# EAGLE design Card4to16_50mm (EAGLE 8.1.1)
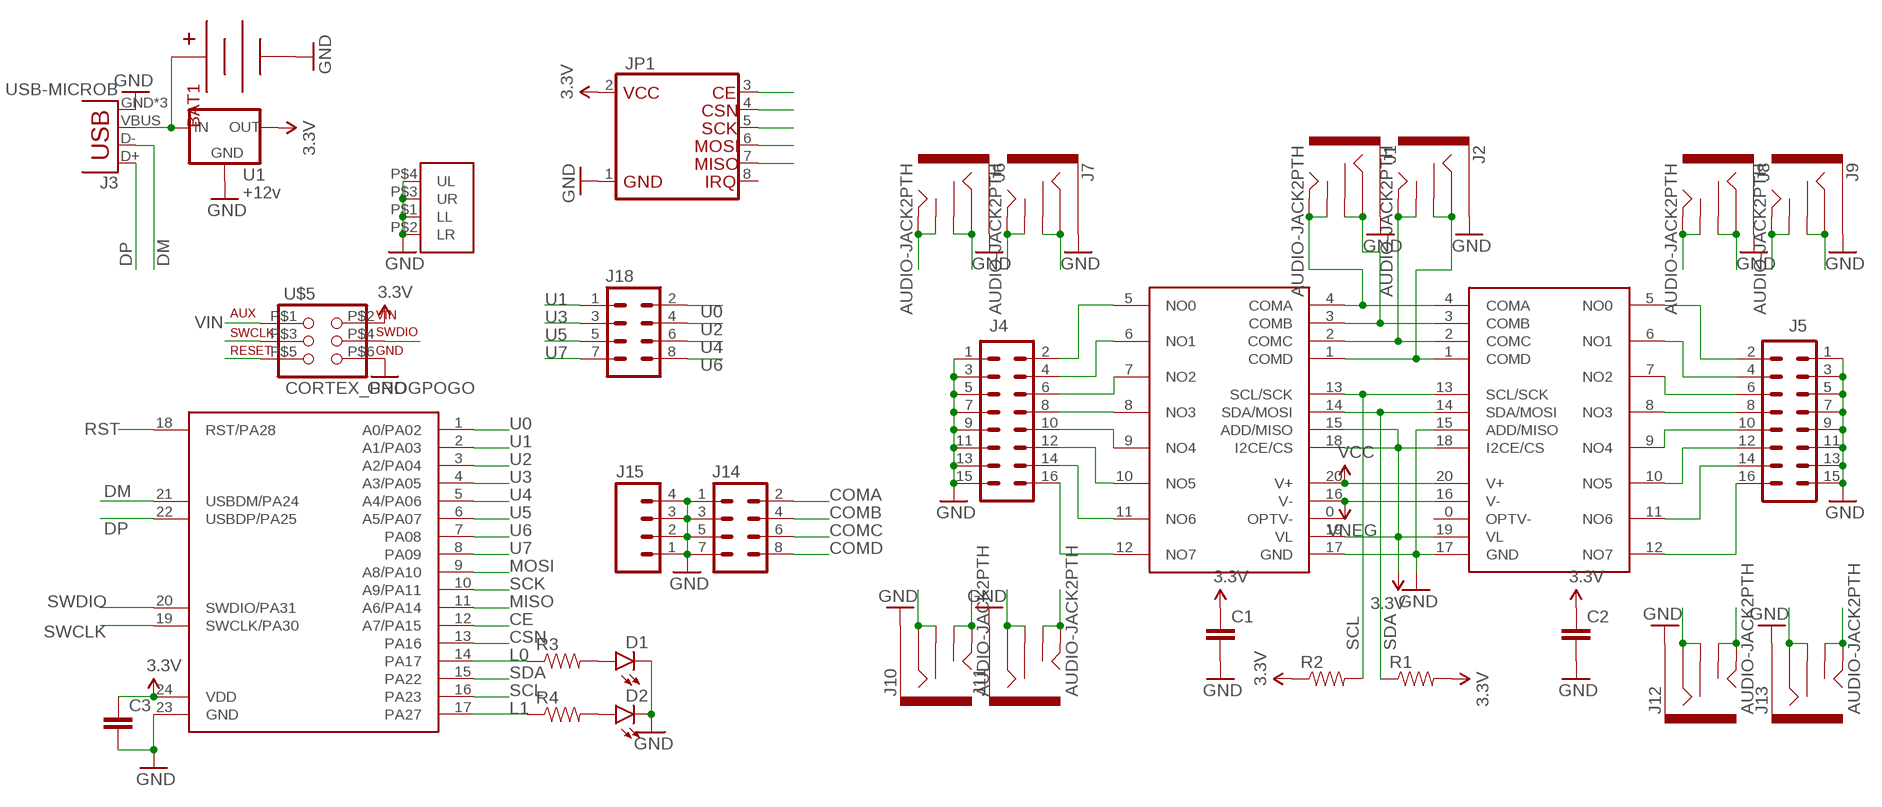
[diagram p0: schematic, sheet 1]

## Parts
BAT1  9VHOLDERCLIPS  [BSPC9V]
C1  CAP0805  [0805]
C2  CAP0805  [0805]
C3  CAP0805  [0805]
D1  LED1206  [LED-1206]
D2  LED1206  [LED-1206]
J1  AUDIO-JACK2PTH  [AUDIO-JACK]
J2  AUDIO-JACK2PTH  [AUDIO-JACK]
J3  USB-MICROB  [USB-MICROB]
J4  M08X2  [2X8]
J5  M08X2  [2X8]
J6  AUDIO-JACK2PTH  [AUDIO-JACK]
J7  AUDIO-JACK2PTH  [AUDIO-JACK]
J8  AUDIO-JACK2PTH  [AUDIO-JACK]
J9  AUDIO-JACK2PTH  [AUDIO-JACK]
J10  AUDIO-JACK2PTH  [AUDIO-JACK]
J11  AUDIO-JACK2PTH  [AUDIO-JACK]
J12  AUDIO-JACK2PTH  [AUDIO-JACK]
J13  AUDIO-JACK2PTH  [AUDIO-JACK]
J14  M04X2  [2X4]
J15  M04PTH  [1X04]
J18  M04X2  [2X4]
JP1  NRF24L01+SHORT_FLUSH  [NRF24L01SHORT]
R1  RESISTOR0603-RES  [0603-RES]
R2  RESISTOR0603-RES  [0603-RES]
R3  RESISTOR0603-RES  [0603-RES]
R4  RESISTOR0603-RES  [0603-RES]
U1  +12v  V_REG_78XX7812  [TO-252]
U$1  MAX14724ETP+QFN  [QFN20_4X4]
U$2  MAX14724ETP+QFN  [QFN20_4X4]
U$3  ATSAMD11D14A-M  [QFN24_4X4]
U$4  CARD_HOLES50MM  [IEC-7810_ID-1_HOLES_50MM]
U$5  CORTEX_PROGPOGO  [2X3_MAX]

## Nets
3.3V: C1.1 C2.1 C3.1 JP1.2(VCC) R1.2 R2.1 U1.2(OUT) U$1.15(ADD/MISO) U$1.18(I2CE/CS) U$1.19(VL) U$2.18(I2CE/CS) U$2.19(VL) U$3.24(VDD) U$5.P$2(VIN)
CE: JP1.3(CE) U$3.12(A7/PA15)
COMA: J1.TIP J1.TSH J14.2 U$1.4(COMA) U$2.4(COMA)
COMB: J1.RING J1.RSH J14.4 U$1.3(COMB) U$2.3(COMB)
COMC: J2.TIP J2.TSH J14.6 U$1.2(COMC) U$2.2(COMC)
COMD: J2.RING J2.RSH J14.8 U$1.1(COMD) U$2.1(COMD)
CSN: JP1.4(CSN) U$3.13(PA16)
DM: J3.D- U$3.21(USBDM/PA24)
DP: J3.D+ U$3.22(USBDP/PA25)
GND: BAT1.P$1(V-) BAT1.P$2(V-) BAT1.P$3(V-) C1.2 C2.2 C3.2 D1.C D2.C J1.SLEEVE J2.SLEEVE J3.GND J3.MT1(GND) J3.MT2(GND) J4.1 J4.3 J4.5 J4.7 J4.9 J4.11 J4.13 J4.15 J5.1 J5.3 J5.5 J5.7 J5.9 J5.11 J5.13 J5.15 J6.SLEEVE J7.SLEEVE J8.SLEEVE J9.SLEEVE J10.SLEEVE J11.SLEEVE J12.SLEEVE J13.SLEEVE J14.1 J14.3 J14.5 J14.7 J15.1 J15.2 J15.3 J15.4 JP1.1(GND) U1.3(GND) U$1.17(GND) U$2.15(ADD/MISO) U$2.17(GND) U$3.23(GND) U$4.P$1(LL) U$4.P$2(LR) U$4.P$3(UR) U$4.P$4(UL) U$5.P$6(GND)
L0: R3.1 U$3.14(PA17)
L1: R4.1 U$3.17(PA27)
MISO: JP1.7(MISO) U$3.11(A6/PA14)
MOSI: JP1.6(MOSI) U$3.9(A8/PA10)
N$1: D1.A R3.2
N$2: D2.A R4.2
OUT1: J4.2 J10.RING J10.RSH U$1.5(NO0)
OUT2: J4.4 J10.TIP J10.TSH U$1.6(NO1)
OUT3: J4.6 J11.RING J11.RSH U$1.7(NO2)
OUT4: J4.8 J11.TIP J11.TSH U$1.8(NO3)
OUT5: J4.10 J12.RING J12.RSH U$1.9(NO4)
OUT6: J4.12 J12.TIP J12.TSH U$1.10(NO5)
OUT7: J4.14 J13.RING J13.RSH U$1.11(NO6)
OUT8: J4.16 J13.TIP J13.TSH U$1.12(NO7)
OUT9: J5.2 J6.RING J6.RSH U$2.5(NO0)
OUT10: J5.4 J6.TIP J6.TSH U$2.6(NO1)
OUT11: J5.6 J7.RING J7.RSH U$2.7(NO2)
OUT12: J5.8 J7.TIP J7.TSH U$2.8(NO3)
OUT13: J5.10 J8.RING J8.RSH U$2.9(NO4)
OUT14: J5.12 J8.TIP J8.TSH U$2.10(NO5)
OUT15: J5.14 J9.RING J9.RSH U$2.11(NO6)
OUT16: J5.16 J9.TIP J9.TSH U$2.12(NO7)
RST: U$3.18(RST/PA28) U$5.P$5(RST)
SCK: JP1.5(SCK) U$3.10(A9/PA11)
SCL: R2.2 U$1.13(SCL/SCK) U$2.13(SCL/SCK) U$3.16(PA23)
SDA: R1.1 U$1.14(SDA/MOSI) U$2.14(SDA/MOSI) U$3.15(PA22)
SWCLK: U$3.19(SWCLK/PA30) U$5.P$3(SWCLK)
SWDIO: U$3.20(SWDIO/PA31) U$5.P$4(SWDIO)
U0: J18.2 U$3.1(A0/PA02)
U1: J18.1 U$3.2(A1/PA03)
U2: J18.4 U$3.3(A2/PA04)
U3: J18.3 U$3.4(A3/PA05)
U4: J18.6 U$3.5(A4/PA06)
U5: J18.5 U$3.6(A5/PA07)
U6: J18.8 U$3.7(PA08)
U7: J18.7 U$3.8(PA09)
VCC: U$1.20(V+) U$2.20(V+)
VIN: BAT1.P$4(V+) BAT1.P$5(V+) BAT1.P$6(V+) J3.VBUS U1.1(IN) U$5.P$1(AUX)
VNEG: U$1.16(V-) U$2.16(V-)
Unconnected: JP1.8(IRQ) U$1.0(OPTV-) U$2.0(OPTV-)

## Library data of the parts
BAT1 = maxorig:9VHOLDER: 9V board-mount battery cradle
C1-C3 = SparkFun-Capacitors:CAP: Capacitor Standard 0603 ceramic capacitor, and 0.1" leaded capacitor.
D1 D2 = SparkFun-LED:LED: LEDs Standard schematic elements and footprints for 5mm, 3mm, 1206, and 0603 sized LEDs. 5mm - Spark Fun Electronics SKU : COM-00529 (and others)
J1 J2 J6-J13 = SparkFun-Connectors:AUDIO-JACK2: Stereo audio jack with bypass switches. SMT version used on LilyPad MP3 board.; PROD_ID: CONN-08774
J3 = SparkFun-Connectors:USB: USB Connectors USB-B-PTH is fully proven SKU : PRT-00139/CONN-08278 USB-miniB is fully proven SKU : PRT-00587 USB-A-PCB is untested. USB-A-H is throughly reviewed, but untested. Spark Fun Electronics SKU : PRT-00437 USB-B-SMT is throughly reviewed, but untested. Needs silkscreen touching up. USB-A-S has not been used/tested USB-MB-H has not been used/tested USB-MICROB has been used. CONN-09505; PROD_ID: CONN-09505
J4 J5 = SparkFun-Connectors:M08X2: .1" headers, two rows of 8 each
J14 J18 = SparkFun-Connectors:M04X2: .1" header, two rows of four.
J15 = maxorig:M04: Header 4 Standard 4-pin 0.1" header. Use with straight break away headers (SKU : PRT-00116), right angle break away headers (PRT-00553), swiss pins (PRT-00743), machine pins (PRT-00117), and female headers (PRT-00115). Molex polarized connector foot print use with SKU : PRT-08231 with associated crimp pins and housings. 1MM SMD Version SKU: PRT-10208; PROD_ID: CONN-09696
JP1 = maxorig:NRF24L01+: Low cost 2.4GHZ ISM radio with extensive Arduino support and mesh networking support. Flush package has holes to allow for entire module to sit flush to PCB if header spacers removed due to through-hole crystal used. Short version has keepout area for trace antenna onboard to avoid signal dampening. Long version's anchor pins are tied to GND but are not required for operation.
R1-R4 = SparkFun-Resistors:RESISTOR: Resistor Basic schematic elements and footprints for 0603, 1206, and PTH resistors.
U1 = SparkFun-PowerIC:V_REG_78XX: Voltage Regulator Standard 78xx regulator. IGO (Input Ground Output). Spark Fun Electronics SKU : COM-00107; PROD_ID: VREG-12370
U$1 U$2 = maxorig:MAX14724ETP+: I2C / SPI mux, 4 to 8 channel, 3 ohm. Great for audio routing, with low resistance and quad busses. Each normally open pin can be tied to any combination or none of the shared busses. I2C mode has 1 address pin for a total of 2 possible addresses.
U$3 = maxorig:ATSAMD11D14A-M: Low pin count 32-bit Cortex M0+ microcontroller in qfn package, USB, 3 sercoms, 10 analog inputs, 22 gpio pins
U$4 = maxorig:CARD_HOLES: Business card size board outline meeting IEC-7810 ID-1 standards. To fully meet spec, use with a 0.6mm or 0.8mm thick PCB. Holes are individually broken out but shoud ideally be tied to ground for connection with metallic enclosure. Paneled versions are 50mm high vs the 53mm in the spec to allow for two to be fit on a 100x100mm board for cost reductions.
U$5 = maxorig:CORTEX_PROG: 2x3 0.1' connector for programming and debugging Cortex M0(+) MCUs Has auxiliary pin broken out for extra testing functionality

## Board
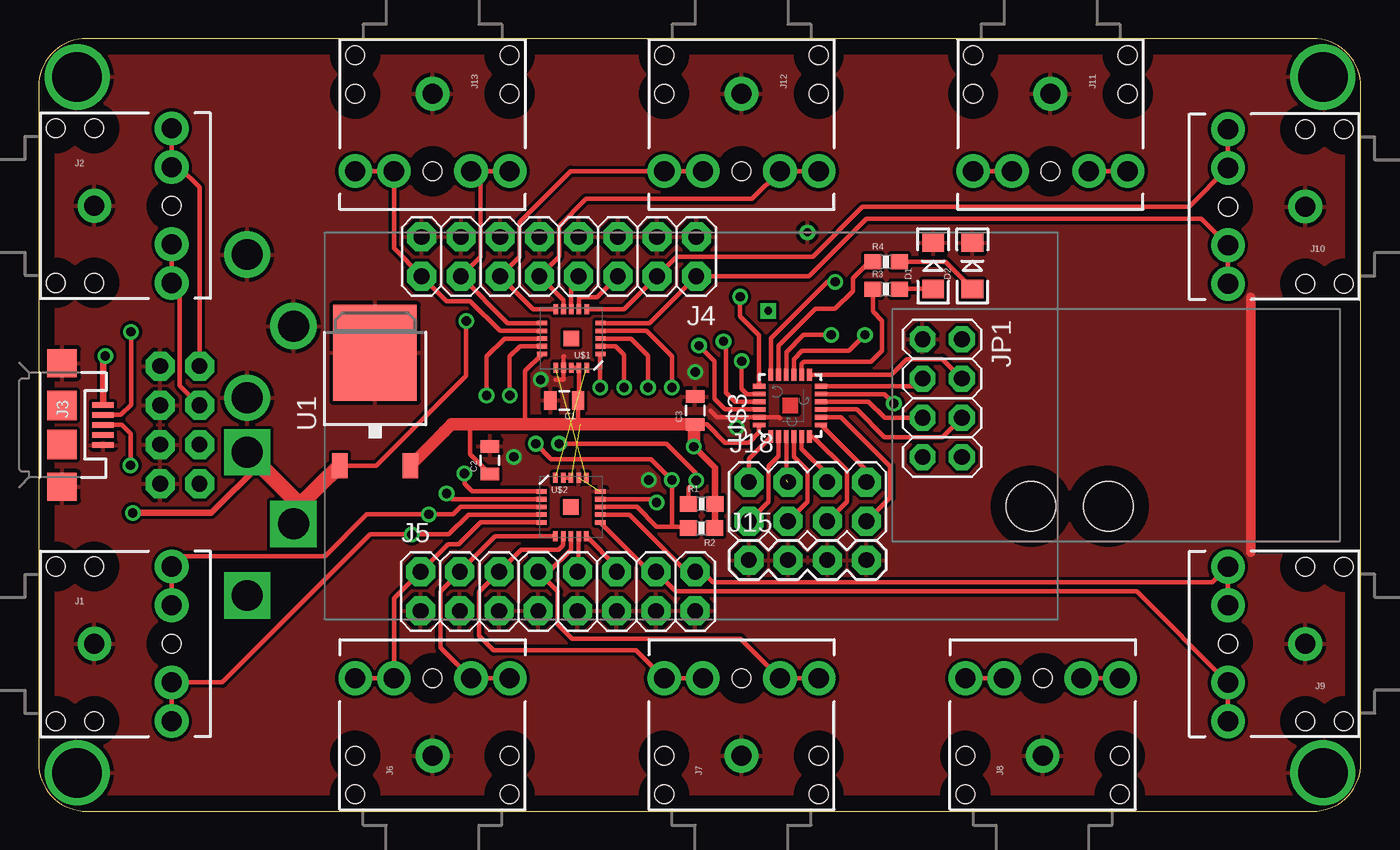
[diagram p1: board, top side]
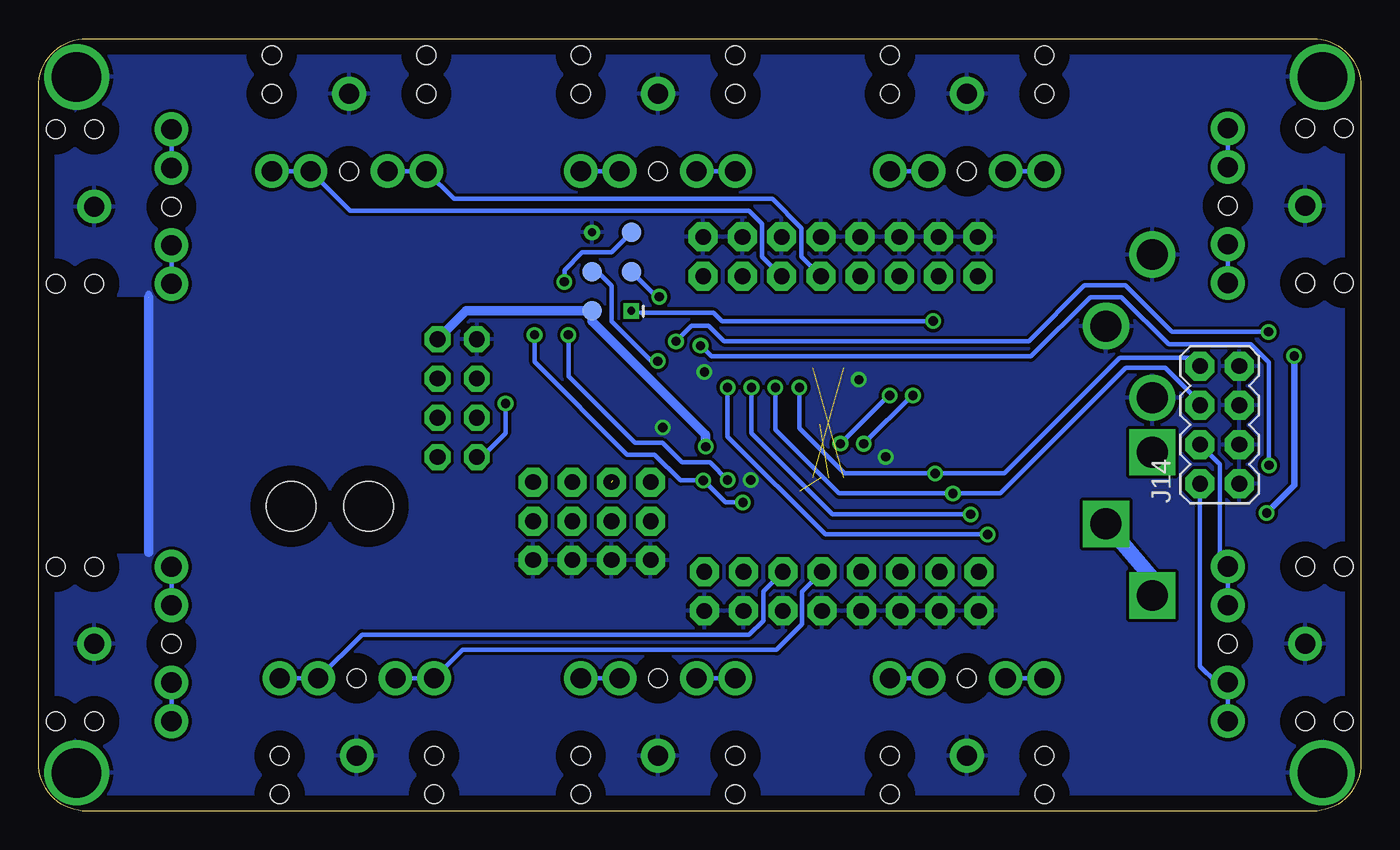
[diagram p2: board, bottom side, seen from below]

Size 85.6 x 50 mm. Coordinates in mm from the lower left corner, seen from the top.
Copper layers (1*16): Top 0.035mm / dielectric 1.5mm / Bottom 0.035mm
Design rules "default": minimum track width 10mil, minimum drill 24mil, track to track 8mil, track to pad 8mil, pad to pad 8mil, via to via 8mil, smd to smd 8mil, copper to edge 40mil, drill to drill 8mil, minimum pad ring 10mil, minimum via ring 8mil, stop-mask expansion 4mil, vias tented up to drill 0mil, thermal gap 10mil

### Footprints (pad centres in the part's own frame; a part is rotated, then mirrored left to right if it is on the bottom)
BSPC9V = drill 2: P$1 0,22.1; P$2 0,12.83; P$3 3,17.465 | drill 2 square: P$4 0,9.3; P$5 0,0.03; P$6 3,4.665
0805 = smd 0.8 x 1.2: 1 -0.9,0; 2 0.9,0
LED-1206 = smd 1.2 x 1.4: A -1.5,0; C 1.5,0
AUDIO-JACK = drill 1.3 pad 2.184: RING 5,5; RSH 5,2.5; SLEEVE 0,0; TIP 5,-5; TSH 5,-2.5 | hole 1.2: 0,5; -2.5,5; -2.5,-5; 0,-5; 5,0
USB-MICROB = smd 0.35 x 1.4: D+ 0,2.65; D- -0.65,2.65; GND 1.3,2.65; ID 0.65,2.65; VBUS -1.3,2.65 | smd 1.8 x 1.9: MT1 -4,0; MT2 4,0 | smd 1.9 x 1.9: P$1 -1.27,0; P$2 1.27,0
2X8 = drill 1.016 pad 1.88 octagon: 1 0,0; 2 0,2.54; 3 2.54,0; 4 2.54,2.54; 5 5.08,0; 6 5.08,2.54; 7 7.62,0; 8 7.62,2.54; 9 10.16,0; 10 10.16,2.54; 11 12.7,0; 12 12.7,2.54; 13 15.24,0; 14 15.24,2.54; 15 17.78,0; 16 17.78,2.54
2X4 = drill 1.016 pad 1.88 octagon: 1 -3.81,-1.27; 2 -3.81,1.27; 3 -1.27,-1.27; 4 -1.27,1.27; 5 1.27,-1.27; 6 1.27,1.27; 7 3.81,-1.27; 8 3.81,1.27
1X04 = drill 1.016 pad 1.88 octagon: 1 0,0; 2 2.54,0; 3 5.08,0; 4 7.62,0
NRF24L01SHORT = drill 1.016 pad 1.676 octagon: 1 -3.81,-1.27; 2 -3.81,1.27; 3 -1.27,-1.27; 4 -1.27,1.27; 5 1.27,-1.27; 6 1.27,1.27; 7 3.81,-1.27; 8 3.81,1.27 | hole 3.2: 7,5.75; 7,10.75
0603-RES = smd 1.1 x 1: 1 -0.85,0; 2 0.85,0
TO-252 = smd 1 x 1.6: 1 -2.28,-4.8; 2 2.28,-4.8 | smd 5.4 x 6.2: 3 0,2.5
QFN20_4X4 = smd 1 x 1: 0 0,0 | smd 0.65 x 0.3: 1 -1.9,1; 2 -1.9,0.5; 3 -1.9,0; 4 -1.9,-0.5; 5 -1.9,-1; 11 1.9,-1; 12 1.9,-0.5; 13 1.9,0; 14 1.9,0.5; 15 1.9,1 | smd 0.3 x 0.65: 6 -1,-1.9; 7 -0.5,-1.9; 8 0,-1.9; 9 0.5,-1.9; 10 1,-1.9; 16 1,1.9; 17 0.5,1.9; 18 0,1.9; 19 -0.5,1.9; 20 -1,1.9
QFN24_4X4 = smd 0.8 x 0.3: 1 -2,1.25; 2 -2,0.75; 3 -2,0.25; 4 -2,-0.25; 5 -2,-0.75; 6 -2,-1.25; 13 2,-1.25; 14 2,-0.75; 15 2,-0.25; 16 2,0.25; 17 2,0.75; 18 2,1.25 | smd 0.3 x 0.8: 7 -1.25,-2; 8 -0.75,-2; 9 -0.25,-2; 10 0.25,-2; 11 0.75,-2; 12 1.25,-2; 19 1.25,2; 20 0.75,2; 21 0.25,2; 22 -0.25,2; 23 -0.75,2; 24 -1.25,2
IEC-7810_ID-1_HOLES_50MM = drill 3.2: P$1 2.49,2.49; P$2 83.135,2.49; P$3 83.135,47.52; P$4 2.49,47.52
2X3_MAX = drill 0.508 square: P$1 -2.54,-1.27 | smd 1.27 x 1.27: P$2 -2.54,1.27; P$3 0,-1.27; P$4 0,1.27; P$5 2.54,-1.27 | drill 0.508: P$6 2.54,1.27

### Placement (x,y rotation side)
BAT1  13.5,13.93 0 top
C1  34.03,26.58 180 top
C2  29.21,22.72 90 top
C3  42.5,25.93 90 top
D1  57.91,35.31 90 top
D2  60.45,35.31 90 top
J1  3.61,10.84 0 top
J2  3.61,39.19 0 top
J3  1.52,25 270 top
J4  42.58,37.17 180 top
J5  24.73,12.96 0 top
J6  25.5,3.6 90 top
J7  45.5,3.6 90 top
J8  65,3.6 90 top
J9  82,10.83 180 top
J10  82,39.13 180 top
J11  65.5,46.43 270 top
J12  45.5,46.43 270 top
J13  25.5,46.43 270 top
J14  9.14,25 90 bottom
J15  45.97,16.26 0 top
J18  49.78,20.04 0 top
JP1  58.5,26.73 270 top
R1  42.93,19.89 0 top
R2  42.92,18.33 180 top
R3  54.86,33.78 0 top
R4  54.86,35.56 0 top
U1  21.78,27.16 0 top
U$1  34.48,30.59 180 top
U$2  34.46,19.7 0 top
U$3  48.65,26.25 90 top
U$4  0,0 0 top
U$5  48.5,34.92 90 bottom

### Tracks (layer width: path | path; a pad name or v marks a point on that pad's centre or on a via)
3.3V  (via drill 0.6)  (1 unrouted)
  Top 0.305: U$2.18 U$2.19 | U$1.18 U$1.19 34.98,26.41 C1.1 34.92,25.16 35.05,25.04 | 42.53,25 C3.1 43.27,25.03 44.45,23.85 45.97,23.85 46.65,24.52 U$3.24 | 31.5,25.04 31.5,28.51 U$1.15 | 29.49,21.59 C2.1 27.94,23.09 27.94,25.04 | 26.25,24.55 26.48,24.55
  Top 0.406: v42.42,23.59 43.78,22.23 R1.2 43.77,19.37 R2.1
  Top 0.813: U1.2 26.25,24.55 26.73,25.04 27.94,25.04 31.5,25.04 35.05,25.04 42,25.04 C3.1 42.42,24.95 v42.42,23.59
  Bottom 0.305: 49.78,32.88 U$5.P$2
  Bottom 0.406: U$5.P$2 49.77,32.5
  Bottom 0.61: v42.42,23.59 42.42,24.35 49.77,31.71 U$5.P$2 57.93,32.38 JP1.2
CE
  Top 0.305: U$3.12 56.73,27.5 JP1.3
COMA  (via drill 0.6)
  Top 0.305: v41,27.43 41,29.43 39.34,31.09 U$1.4 | J1.TIP J1.TSH 11.89,8.34 21.47,17.91 v24.16,17.91 26.55,17.91 27.83,19.2 U$2.4
  Bottom 0.305: J1.TIP J1.TSH 9.35,8.34 10.41,9.4 J14.2 | v41,27.43 41,24.24 34.67,17.91 v24.16,17.91
COMB  (via drill 0.6)
  Top 0.305: U$1.3 38.34,30.59 39.45,29.48 v39.45,27.43 | J1.RSH J1.RING 9.28,16.51 18.54,16.51 21.25,19.22 v25.26,19.22 26.84,19.22 27.32,19.7 U$2.3
  Bottom 0.305: J1.RSH J1.RING 9.14,16.37 9.14,22.46 J14.4 | v39.45,27.43 39.45,24.46 34.2,19.22 v25.26,19.22
COMC  (via drill 0.6)
  Top 0.305: U$1.2 37.34,30.09 37.9,29.53 v37.9,27.43 | J2.TSH J2.TIP 9.14,33.66 9.14,27.54 J14.6 | U$2.2 26.78,20.2 v26.41,20.57
  Bottom 0.305: v26.41,20.57 26.71,20.77 | v26.41,20.57 23.35,20.58 15.23,28.7 12.65,28.7 10.41,26.47 J14.6 | J2.TSH J2.TIP 8.61,34.06 | v37.9,27.43 37.9,24.69 33.77,20.57 v26.41,20.57
COMD  (via drill 0.6)
  Top 0.305: v36.35,27.43 36.35,29.56 U$1.1 | J2.RING J2.RSH 9.11,41.69 10.41,40.39 J14.8 | v27.56,21.87 27.56,21.21 28.07,20.7 U$2.1
  Bottom 0.305: v36.35,27.43 36.35,24.8 33.42,21.87 v27.56,21.87 23.09,21.87 15.6,29.36 10.97,29.36 J14.8 | J2.RSH J2.RING
CSN
  Top 0.305: U$3.13 55.2,28.25 56.22,29.26 58.5,29.26 59.76,28 JP1.4
DM  (via drill 0.6)
  Top 0.305: U$3.21 45.07,26.5 44.49,27.08 44.49,30.26 v44.34,30.41 | J3.D- 5.33,25.65 5.98,26.3 v5.98,31.03
  Bottom 0.305: v44.34,30.41 43.32,31.43 42.24,31.43 41.24,30.43 21.5,30.43 17.89,34.04 15.24,34.04 12.23,31.03 v5.98,31.03
DP  (via drill 0.6)
  Top 0.305: J3.D+ 5.38,25 5.95,24.43 v5.95,22.39 | U$3.22 44.43,26 43.75,26.68 43.75,29.13 v42.75,30.13
  Bottom 0.305: v42.75,30.13 42.04,29.43 21.37,29.43 17.53,33.27 15.49,33.27 12.45,30.23 7.11,30.23 5.95,29.07 v5.95,22.39
GND  (via drill 0.6)  (2 unrouted)
  Top 0.305: 33.48,27.93 33.98,27.93 U$1.17 33.98,29.43 34,29.43 | 43.5,25.93 43.93,25.5 U$3.23 47.93,25.5 48,25.43
  Top 0.61: 78.49,33.27 78.49,16.76
  Bottom 0.406: J10.SLEEVE 81.62,38.75 | 78.49,33.27 78.49,33.5
  Bottom 0.61: 78.49,16.76 78.49,33.27
  other vias: 32.5,27.93 30.77,22.94 45.2,24.84 42.5,28.43 39.5,21.44
  pour Bottom: -5,-2.5 -5.5,57.5 89,56.5 90,-3.5
  pour Top: 89.5,-3.5 89.5,56.5 -5.5,56 -5,-2.5
L0
  Top 0.305: U$3.14 49.4,28.93 49.55,29.08 53.89,29.08 54.61,29.81 54.61,31.75 54.01,32.35 R3.1
L1
  Top 0.305: U$3.17 47.9,30.12 50.29,32.51 51.56,32.51 52.7,33.66 52.7,34.49 53.77,35.56 R4.1
MISO  (via drill 0.6)
  Top 0.305: U$3.11 54.76,27 v55.37,26.39
  Bottom 0.305: v55.37,26.39 55.37,24.48 56.93,22.92 JP1.7
MOSI
  Top 0.305: U$3.9 52.96,26 54.76,24.21 58.52,24.21 JP1.6
N$1
  Top 0.305: R3.2 55.74,33.81 D1.A
N$2
  Top 0.305: D2.A 58.7,35.56 R4.2
OUT1
  Top 0.305: J10.RING J10.RSH 75.28,38.35 53.59,38.35 49.87,34.63 J4.2 39.54,31.59 U$1.5
  Bottom 0.305: J10.RING J10.RSH
OUT2
  Top 0.305: J10.TIP J10.TSH 74.49,39.12 53.34,39.12 50.11,35.89 41.3,35.89 J4.4 37.9,32.49 U$1.6
  Bottom 0.305: J10.TSH J10.TIP
OUT3
  Top 0.305: J11.RSH J11.RING | U$1.7 34.98,33.2 35.05,33.27 36.14,33.27 J4.6
  Bottom 0.305: J11.RING J11.RSH 65.43,38.86 39.6,38.86 38.76,38.02 38.76,35.89 J4.6
OUT4
  Top 0.305: J11.TIP J11.TSH | U$1.8 34.48,34.15 J4.8
  Bottom 0.305: J11.TSH J11.TIP 58.69,39.62 38.1,39.62 36.22,37.74 36.22,35.89 J4.8
OUT5
  Top 0.305: J12.RING J12.RSH 46.19,39.62 35.43,39.62 33.68,37.87 33.68,35.89 J4.10 33.98,33.06 U$1.9
  Bottom 0.305: J12.RING J12.RSH
OUT6
  Top 0.305: J12.TSH J12.TIP 34.45,41.43 31.14,38.12 31.14,35.89 J4.12 32.01,32.49 U$1.10
  Bottom 0.305: J12.TSH J12.TIP
OUT7
  Top 0.305: J13.RING J13.RSH 28.6,41.43 28.6,35.89 J4.14 30.37,31.59 U$1.11
  Bottom 0.305: J13.RING J13.RSH
OUT8
  Top 0.305: J13.TIP J13.TSH 23,36.42 J4.16 26.4,33.02 27.94,33.02 29.87,31.09 U$1.12
  Bottom 0.305: J13.TIP J13.TSH
OUT9
  Top 0.305: J6.RING J6.RSH 23,13.78 J5.2 26.5,17.27 27.18,17.27 28.6,18.7 U$2.5
  Bottom 0.305: J6.RING J6.RSH
OUT10
  Top 0.305: J6.TIP J6.TSH 26.01,10.59 26.01,14.25 J5.4 29.56,17.8 U$2.6
  Bottom 0.305: J6.TSH J6.TIP
OUT11
  Top 0.305: J7.RSH J7.RING 38.69,10.41 29.46,10.41 28.52,11.35 28.52,14.2 29.81,15.48 J5.6 31.22,16.92 33.66,16.92 33.96,17.22 U$2.7
  Bottom 0.305: J7.RSH J7.RING
OUT12
  Top 0.305: J7.TIP J7.TSH 45.42,11.18 34.54,11.18 33.6,12.12 33.6,14.22 32.35,15.48 J5.8 33.03,15.5 34.46,16.93 U$2.8
  Bottom 0.305: J7.TSH J7.TIP
OUT13
  Top 0.305: J8.RSH J8.RING | U$2.9 34.96,15.58 J5.10
  Bottom 0.305: J8.RSH J8.RING 58.16,10.44 37.82,10.44 36.17,12.09 36.17,14.22 J5.10
OUT14
  Top 0.305: J8.TSH J8.TIP | U$2.10 37.43,15.83 J5.12
  Bottom 0.305: J8.TIP J8.TSH 64.67,11.43 39.6,11.43 38.68,12.34 38.68,14.24 J5.12
OUT15
  Top 0.305: J9.RING J9.RSH 71.11,14.22 41.24,14.22 J5.14 39.55,15.5 U$2.11
  Bottom 0.305: J9.RING J9.RSH
OUT16
  Top 0.305: J9.TSH J9.TIP 75.98,14.81 43.66,14.81 42.97,15.5 J5.16 | U$2.12 38.26,19.2 41.95,15.5 J5.16 | 42.93,15.5 J5.16
  Bottom 0.305: J9.TSH J9.TIP
RST  (via drill 0.6)
  Top 0.305: U$3.18 47.4,30.61 51.05,34.26 v51.56,34.26
  Bottom 0.305: v51.56,34.26 51.56,35.02 50.42,36.16 48.53,36.16 U$5.P$5
SCK
  Top 0.305: U$3.10 53.73,26.5 54.77,25.46 JP1.5
SCL  (via drill 0.6)
  Top 0.305: v41,21.43 40.5,21.93 | U$1.13 30.16,30.59 29,29.43 v29,26.91 | 41,18.41 v41,21.43 | 41,18.41 41.99,18.41 R2.2 | v32.19,23.78 33.19,22.78 39.65,22.78 v41,21.43 | 41,18.41 40.01,18.41 38.73,19.7 U$2.13 | U$3.16 48.4,29.71 49.52,30.83 v51.31,30.83
  Bottom 0.305: v29,26.91 29,26.95 v32.19,23.78 | v41,21.43 42.15,22.58 43.94,22.58 45.21,23.85 46.99,23.85 51.31,28.16 v51.31,30.83
SDA  (via drill 0.6)
  Top 0.305: U$1.14 31.16,30.09 30.5,29.43 v30.5,26.91 | v33.69,23.79 40.64,23.79 42.57,21.86 v42.57,21.41 42.08,20.92 R1.1 | v40.01,19.98 39.8,20.2 U$2.14 | U$3.15 48.9,29.27 49.43,29.79 52.46,29.79 v53.49,30.83
  Bottom 0.305: v33.69,23.79 30.5,26.98 v30.5,26.91 | v40.01,19.98 41.15,19.98 v42.57,21.41 44.04,21.41 45.72,23.08 47.5,23.08 53.49,29.08 v53.49,30.83
SWCLK  (via drill 0.6)
  Top 0.305: U$3.19 46.65,30.79 45.41,32.02 v45.41,33.3
  Bottom 0.305: U$5.P$3 45.6,33.3 v45.41,33.3
SWDIO  (via drill 0.6)
  Top 0.305: v45.52,29.13 45.52,27.35 45.87,27 U$3.20
  Bottom 0.305: U$5.P$4 49.77,35.26 48.51,34.01 48.51,31.72 45.92,29.13 v45.52,29.13
U0
  Top 0.305: U$3.1 45.97,22.82 J18.2
U1
  Top 0.305: 47.9,23.99 U$3.2 47.9,22.98 47.24,22.32 47.24,20.04 J18.1
U2  (1 unrouted)
  Top 0.305: 48.4,21.42 U$3.3
U3
  Top 0.305: U$3.4 48.9,22.95 49.78,22.07 49.78,20.04 J18.3
U4
  Top 0.305: U$3.5 49.4,23.47 51.05,21.81 J18.6
U5
  Top 0.305: U$3.6 50.14,24.25 52.32,22.07 52.32,20.04 J18.5
U6
  Top 0.305: U$3.7 53.59,22.06 J18.8
U7
  Top 0.305: U$3.8 51.94,25.5 55.12,22.32 55.12,20.29 J18.7
VCC  (1 unrouted)
VIN  (via drill 0.6)
  Top 0.305: v27.69,31.72 27.69,28.19 21.86,22.36 U1.1
  Top 0.406: 13,23.23 BAT1.P$4 | J3.VBUS 4.17,29.32 v4.32,29.46 | v6.1,19.3 11.18,19.3 14.3,22.43
  Top 1.016: U1.1 16.64,19.57 16.5,19.43 BAT1.P$6 16.5,20.23 14.3,22.43 BAT1.P$4
  Bottom 0.305: v27.69,31.72 41.37,31.72 41.91,32.26 46.6,32.26 U$5.P$1
  Bottom 0.406: v4.32,29.46 4.32,21.08 v6.1,19.3
  Bottom 1.016: BAT1.P$5 13.5,15.1 BAT1.P$6
VNEG  (1 unrouted)